# EAGLE design A214B (EAGLE 6.6.0)
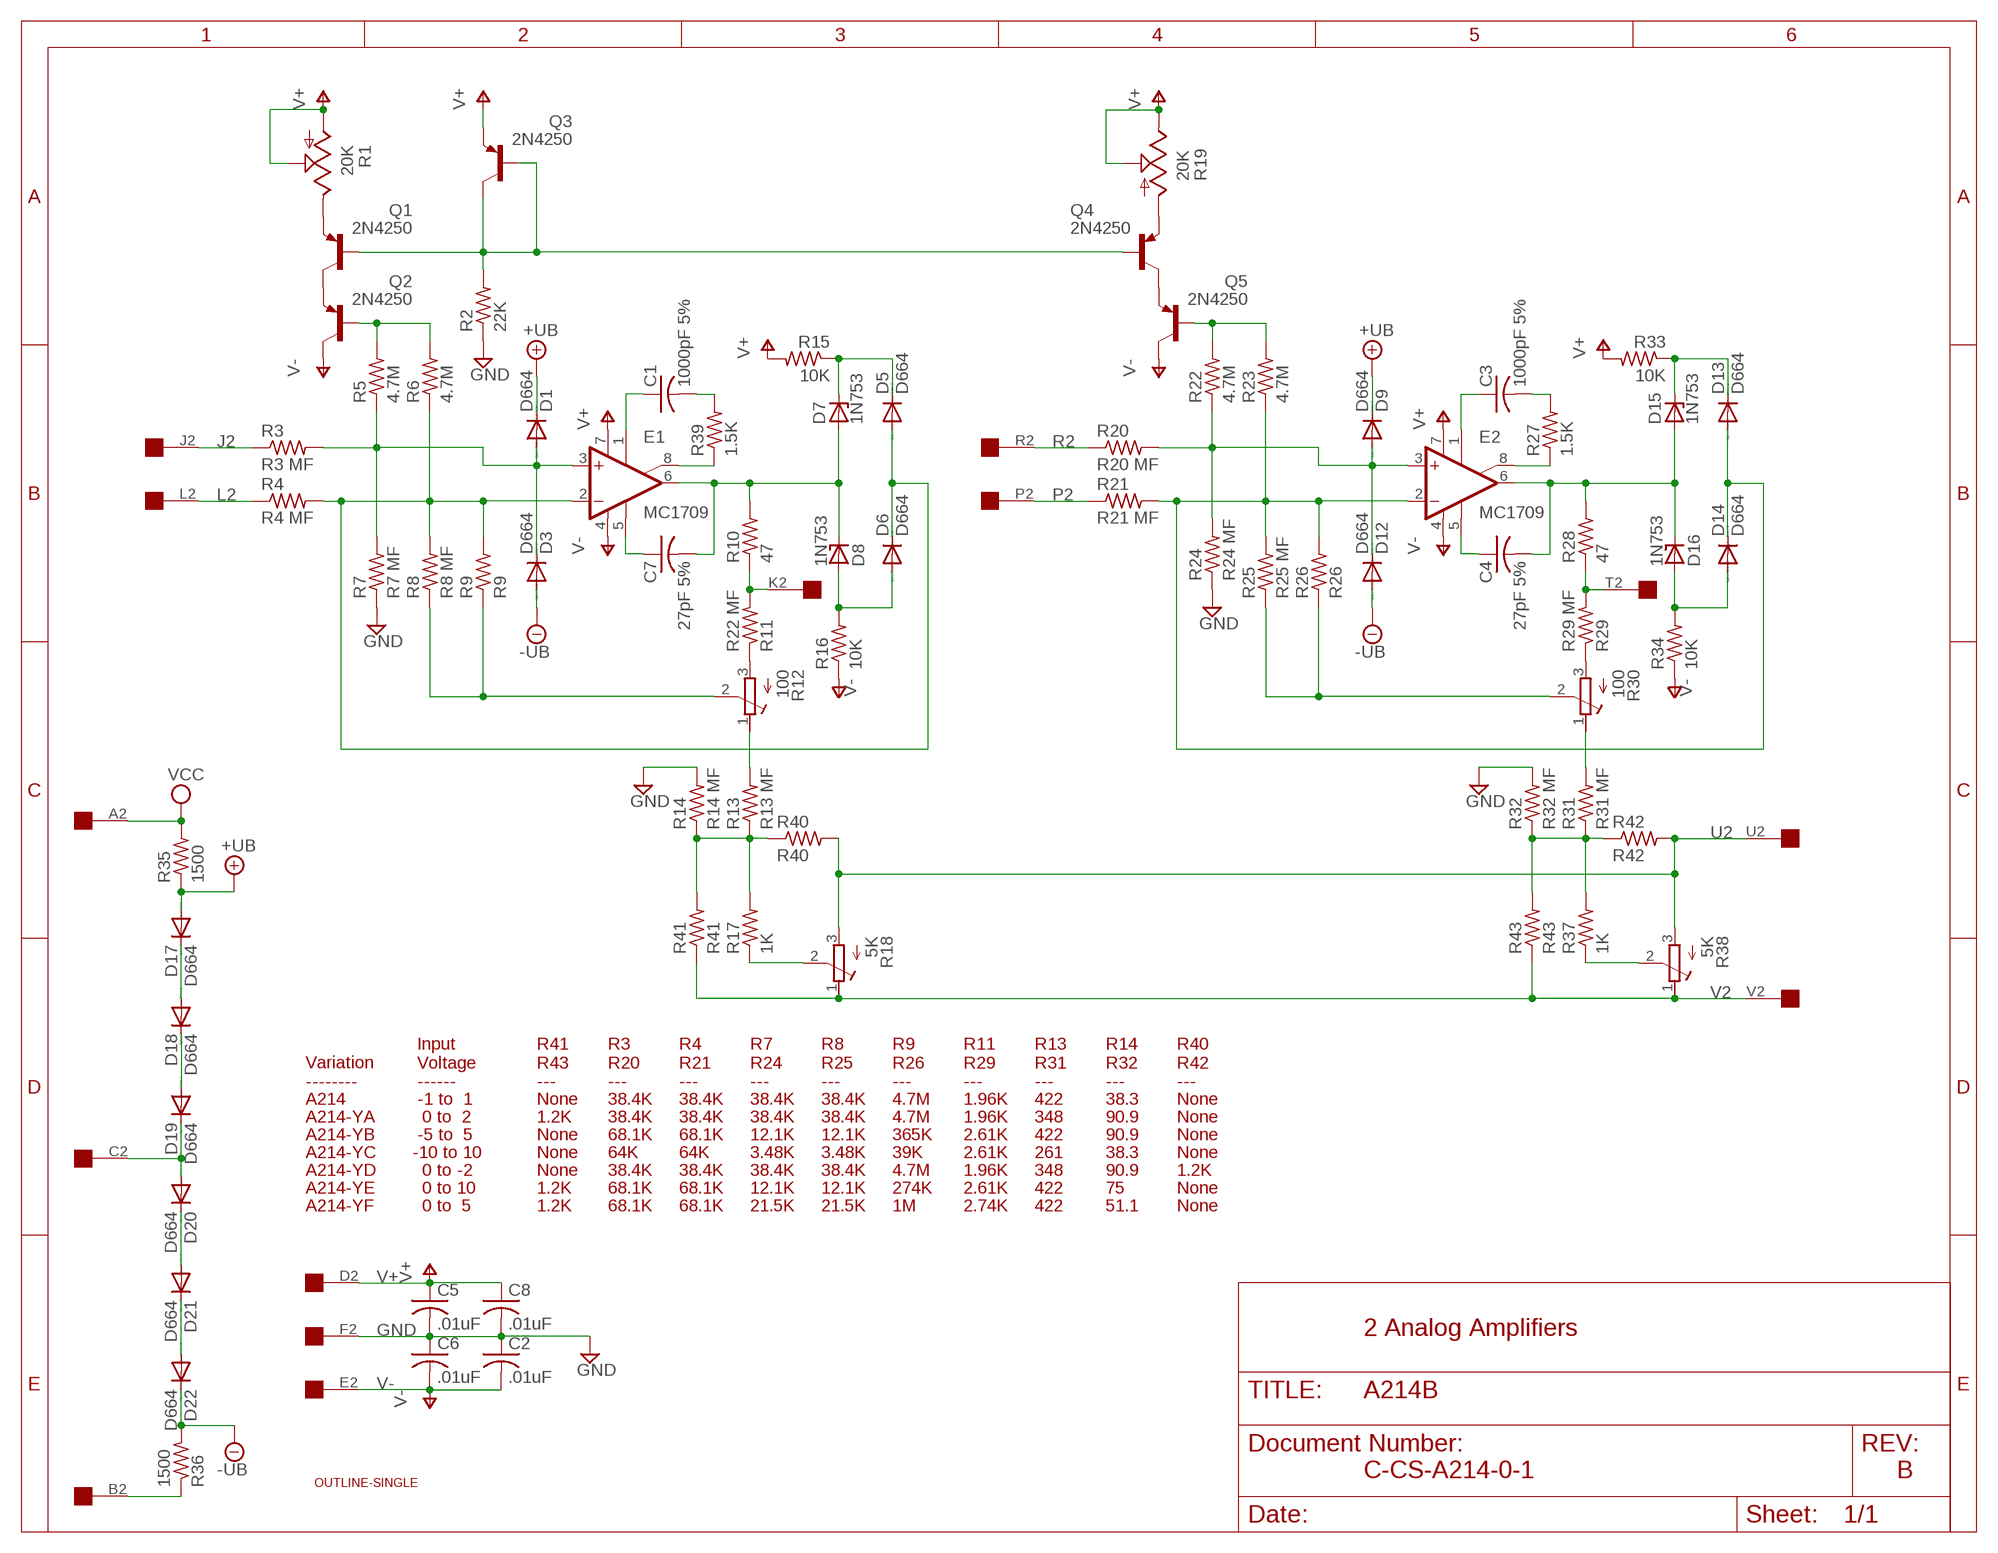
[diagram p0: schematic, sheet 1]

## Parts
C1  1000pF 5%  C-US050-030X075  [C050-030X075]
C2  .01uF  C-US  [C063-025X075]
C3  1000pF 5%  C-US050-030X075  [C050-030X075]
C4  27pF 5%  C-US  [C063-025X075]
C5  .01uF  C-US  [C063-025X075]
C6  .01uF  C-US  [C063-025X075]
C7  27pF 5%  C-US  [C063-025X075]
C8  .01uF  C-US  [C063-025X075]
D1  D664  DIODE-DO35-10  [DO35-10]
D3  D664  DIODE-DO35-10  [DO35-10]
D5  D664  DIODE-DO35-10  [DO35-10]
D6  D664  DIODE-DO35-10  [DO35-10]
D7  1N753  ZENER-DIODEDO41Z10  [DO41Z10]
D8  1N753  ZENER-DIODEDO41Z10  [DO41Z10]
D9  D664  DIODE-DO35-10  [DO35-10]
D12  D664  DIODE-DO35-10  [DO35-10]
D13  D664  DIODE-DO35-10  [DO35-10]
D14  D664  DIODE-DO35-10  [DO35-10]
D15  1N753  ZENER-DIODEDO41Z10  [DO41Z10]
D16  1N753  ZENER-DIODEDO41Z10  [DO41Z10]
D17  D664  DIODE-DO35-10  [DO35-10]
D18  D664  DIODE-DO35-10  [DO35-10]
D19  D664  DIODE-DO35-10  [DO35-10]
D20  D664  DIODE-DO35-10  [DO35-10]
D21  D664  DIODE-DO35-10  [DO35-10]
D22  D664  DIODE-DO35-10  [DO35-10]
E1  MC1709  [H08C]
E2  MC1709  [H08C]
Q1  2N4250  -PNP-TO5  [TO5]
Q2  2N4250  -PNP-TO5  [TO5]
Q3  2N4250  -PNP-TO5  [TO5]
Q4  2N4250  -PNP-TO5  [TO5]
Q5  2N4250  -PNP-TO5  [TO5]
R1  20K  TRIM_US-B25P  [B25P]
R2  22K  R-US_0207/10  [0207/10]
R3  R3 MF  R-US_0207/15  [0207/15]
R4  R4 MF  R-US_0207/15  [0207/15]
R5  4.7M  R-US_0207/10  [0207/10]
R6  4.7M  R-US_0207/10  [0207/10]
R7  R7 MF  R-US_0207/15  [0207/15]
R8  R8 MF  R-US_0207/15  [0207/15]
R9  R9  R-US_0207/10  [0207/10]
R10  47  R-US_0207/10  [0207/10]
R11  R22 MF  R-US_0207/15  [0207/15]
R12  100  275P  [3006Y]
R13  R13 MF  R-US_0207/15  [0207/15]
R14  R14 MF  R-US_0207/15  [0207/15]
R15  10K  R-US_0207/10  [0207/10]
R16  10K  R-US_0207/10  [0207/10]
R17  1K  R-US_0207/10  [0207/10]
R18  5K  275P  [3006Y]
R19  20K  TRIM_US-B25P  [B25P]
R20  R20 MF  R-US_0207/15  [0207/15]
R21  R21 MF  R-US_0207/15  [0207/15]
R22  4.7M  R-US_0207/10  [0207/10]
R23  4.7M  R-US_0207/10  [0207/10]
R24  R24 MF  R-US_0207/15  [0207/15]
R25  R25 MF  R-US_0207/15  [0207/15]
R26  R26  R-US_0207/10  [0207/10]
R27  1.5K  R-US_0207/10  [0207/10]
R28  47  R-US_0207/10  [0207/10]
R29  R29 MF  R-US_0207/15  [0207/15]
R30  100  275P  [3006Y]
R31  R31 MF  R-US_0207/15  [0207/15]
R32  R32 MF  R-US_0207/15  [0207/15]
R33  10K  R-US_0207/10  [0207/10]
R34  10K  R-US_0207/10  [0207/10]
R35  1500  R-US_0207/10  [0207/10]
R36  1500  R-US_0207/10  [0207/10]
R37  1K  R-US_0207/10  [0207/10]
R38  5K  275P  [3006Y]
R39  1.5K  R-US_0207/10  [0207/10]
R40  R40  R-US_0207/10  [0207/10]
R41  R41  R-US_0207/10  [0207/10]
R42  R42  R-US_0207/10  [0207/10]
R43  R43  R-US_0207/10  [0207/10]
U$1  OUTLINE-SINGLE  [SINGLE]
U$2  SINGLE  [EDGE-CON2]

## Nets
+UB: D1.C D9.C D17.A R35.1
-UB: D3.A D12.A D22.C R36.2
B2: R36.1 U$2.B2
GND: C2.1 C5.2 C6.1 C8.2 R2.1 R7.1 R14.2 R24.1 R32.2 U$2.F2
J2: R3.1 U$2.J2
K2: R10.1 R11.2 U$2.K2
L2: R4.1 U$2.L2
N$1: Q1.1(E) R1.E
N$2: Q1.3(C) Q2.1(E)
N$3: Q2.2(B) R5.2 R6.2
N$4: Q1.2(B) Q3.2(B) Q3.3(C) Q4.2(B) R2.2
N$5: D1.A D3.C E1.3(+IN) R3.2 R5.1 R7.2
N$6: D5.A D6.C E1.2(-IN) R4.2 R6.1 R8.2 R9.2
N$7: R8.1 R9.1 R12.2(S)
N$8: C1.1 E1.1(ON1)
N$9: D17.C D18.A
N$10: C1.2 R39.2
N$11: D21.C D22.A
N$12: D20.C D21.A
N$13: D19.C D20.A U$2.C2
N$14: D18.C D19.A
N$15: E1.8(ON2) R39.1
N$16: C7.1 E1.5(OPT)
N$17: C7.2 D7.A D8.C E1.6(OUT) R10.2
N$18: D6.A D8.A R16.2
N$19: D5.C D7.C R15.1
N$20: Q4.1(E) R19.A
N$21: R11.1 R12.3(E)
N$22: R12.1(A) R13.2
N$23: R13.1 R14.1 R17.2 R40.1 R41.2
N$24: R17.1 R18.2(S)
N$25: C3.2 R27.2
N$28: Q4.3(C) Q5.1(E)
N$30: Q5.2(B) R22.2 R23.2
N$31: D9.A D12.C E2.3(+IN) R20.2 R22.1 R24.2
N$32: R25.1 R26.1 R30.2(S)
N$33: C3.1 E2.1(ON1)
N$34: C4.2 D15.A D16.C E2.6(OUT) R28.2
N$35: E2.8(ON2) R27.1
N$36: C4.1 E2.5(OPT)
N$38: D14.A D16.A R34.2
N$39: D13.C D15.C R33.1
N$40: D13.A D14.C E2.2(-IN) R21.2 R23.1 R25.2 R26.2
N$42: R29.1 R30.3(E)
N$43: R30.1(A) R31.2
N$44: R31.1 R32.1 R37.2 R42.1 R43.2
N$45: R37.1 R38.2(S)
P2: R21.1 U$2.P2
R2: R20.1 U$2.R2
T2: R28.1 R29.2 U$2.T2
U2: R18.3(E) R38.3(E) R40.2 R42.2 U$2.U2
V2: R18.1(A) R38.1(A) R41.1 R43.1 U$2.V2
V+: C5.1 C8.1 E1.7(V+) E2.7(V+) Q3.1(E) R1.A R1.S R15.2 R19.E R19.S R33.2 U$2.D2
V-: C2.2 C6.2 E1.4(V-) E2.4(V-) Q2.3(C) Q5.3(C) R16.1 R34.1 U$2.E2
VCC: R35.2 U$2.A2
Unconnected: U$2.A1 U$2.B1 U$2.C1 U$2.D1 U$2.E1 U$2.F1 U$2.H1 U$2.H2 U$2.J1 U$2.K1 U$2.L1 U$2.M1 U$2.M2 U$2.N1 U$2.N2 U$2.P1 U$2.R1 U$2.S1 U$2.S2 U$2.T1 U$2.U1 U$2.V1

## Notes on the sheet
- Variation
  --------
- Input
   Voltage
   ------
- R41
  R43
  ---
- R3
  R20
  ---
- R4
  R21
  ---
- R7
  R24
  ---
- R8
  R25
  ---
- R9
  R26
  ---
- R11
  R29
  ---
- R13
  R31
  ---
- R14
  R32
  ---
- R40
  R42
  ---
- A214 | -1 to  1 | None | 38.4K | 38.4K | 38.4K | 38.4K | 4.7M | 1.96K | 422 | 38.3 | None
- A214-YA | 0 to  2 | 1.2K | 38.4K | 38.4K | 38.4K | 38.4K | 4.7M | 1.96K | 348 | 90.9 | None
- A214-YB | -5 to  5 | None | 68.1K | 68.1K | 12.1K | 12.1K | 365K | 2.61K | 422 | 90.9 | None
- A214-YC | -10 to 10 | None | 64K | 64K | 3.48K | 3.48K | 39K | 2.61K | 261 | 38.3 | None
- A214-YD | 0 to -2 | None | 38.4K | 38.4K | 38.4K | 38.4K | 4.7M | 1.96K | 348 | 90.9 | 1.2K
- A214-YE | 0 to 10 | 1.2K | 68.1K | 68.1K | 12.1K | 12.1K | 274K | 2.61K | 422 | 75 | None
- A214-YF | 0 to  5 | 1.2K | 68.1K | 68.1K | 21.5K | 21.5K | 1M | 2.74K | 422 | 51.1 | None
- 2 Analog Amplifiers
- C-CS-A214-0-1 | B

## Library data of the parts
C1 C3 = rcl:C-US: CAPACITOR, American symbol
C2 C4-C8 = dec-con:C-US: Capacitors with funky DEC lead spacing.
D1 D3 D5 D6 D9 D12-D14 D17-D22 = diode:DIODE-: DIODE
D7 D8 D15 D16 = diode:ZENER-DIODE: Z-Diode
E1 E2 = dec-con:MC1709: OP AMP
Q1-Q5 = transistor:*-PNP-: PNP Transistror
R1 R19 = pot:TRIM_US-: POTENTIOMETER
R2-R11 R13-R17 R20-R29 R31-R37 R39-R43 = rcl:R-US_: RESISTOR, American symbol
R12 R18 R30 R38 = dec-con:275P: Trimpot with 275P (3006Y) footprint.
U$1 = dec-con:OUTLINE-*: Board outlines for DEC boards.
U$2 = dec-con:SINGLE: Single-Height DEC board

## Board
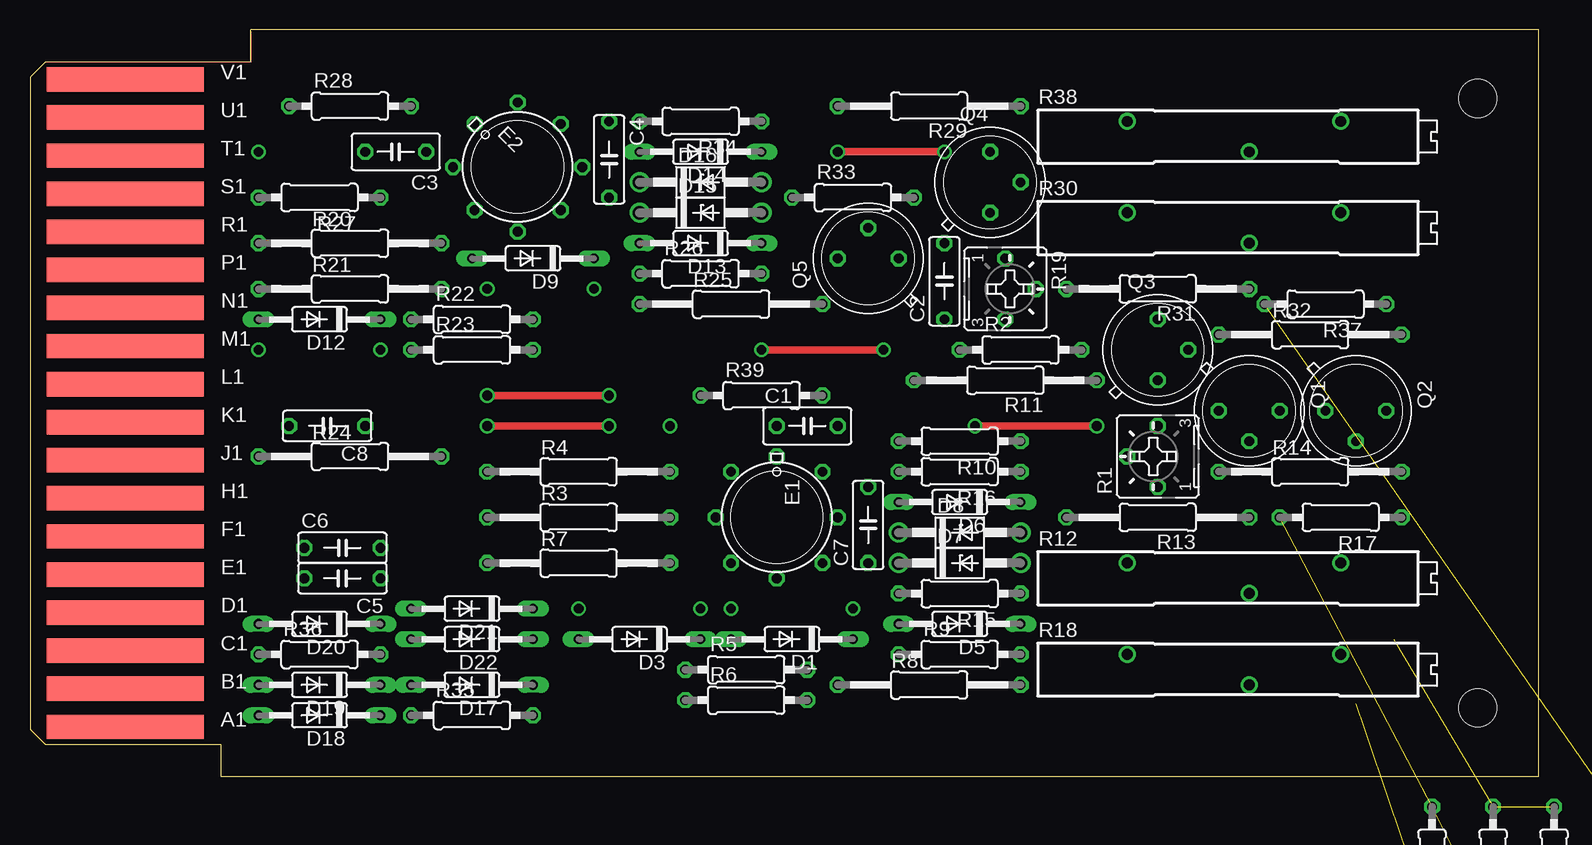
[diagram p1: board, top side]
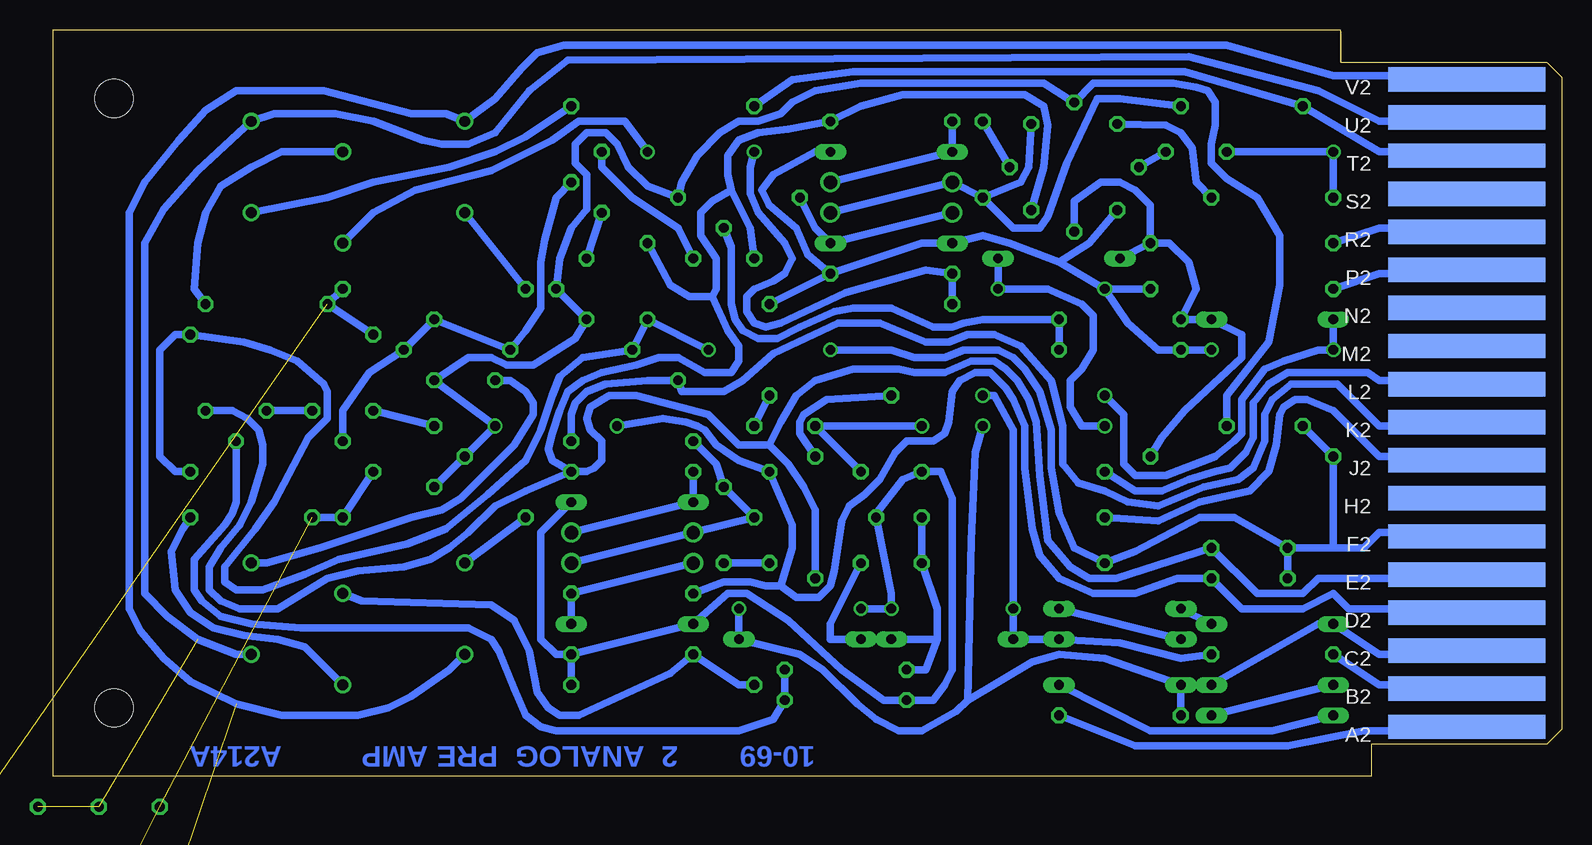
[diagram p2: board, bottom side, seen from below]

Size 125.73 x 62.23 mm. Coordinates in mm from the lower left corner, seen from the top.
Copper layers (1+16): Top 0.035mm / dielectric 1.5mm / Bottom 0.035mm
Design rules "16mils *": minimum track width 16mil, minimum drill 32mil, track to track 13mil, track to pad 10mil, pad to pad 10mil, via to via 10mil, smd to smd 10mil, copper to edge 13mil, drill to drill 10mil, minimum pad ring 10mil, minimum via ring 8mil, stop-mask expansion 0mil, vias tented up to drill 0mil, thermal gap 10mil

### Footprints (pad centres in the part's own frame; a part is rotated, then mirrored left to right if it is on the bottom)
C050-030X075 = drill 0.813 octagon: 1 -2.54,0; 2 2.54,0
C063-025X075 = drill 0.813 octagon: 1 -2.54,0; 2 3.81,0
DO35-10 = drill 0.813 long: A 5.08,0; C -5.08,0
DO41Z10 = drill 1.118: A 5.08,0; C -5.08,0
H08C = drill 0.813 octagon: 1 -3.81,-3.81; 2 0,-5.08; 3 3.81,-3.81; 4 5.08,0; 5 3.81,3.81; 6 0,5.08; 7 -3.81,3.81; 8 -5.08,0
TO5 = drill 0.813 octagon: 1 0,-2.54; 2 2.54,0; 3 0,2.54
B25P = drill 0.813 octagon: A -2.54,0; E 2.54,0; S 0,2.54
0207/10 = drill 0.813 octagon: 1 -5.08,0; 2 5.08,0
0207/15 = drill 0.813 octagon: 1 -7.62,0; 2 7.62,0
3006Y = drill 0.9: 1 -8.89,1.27; 2 1.27,-1.27; 3 8.89,1.27
SINGLE = hole 3.175: 120.65,56.515; 120.65,5.715
EDGE-CON2 = smd 13.106 x 2.032: A1 7.938,4.128; B1 7.938,7.303; C1 7.938,10.477; D1 7.938,13.652; E1 7.938,16.828; F1 7.938,20.003; H1 7.938,23.177; J1 7.938,26.352; K1 7.938,29.527; L1 7.938,32.703; M1 7.938,35.877; N1 7.938,39.053; P1 7.938,42.227; R1 7.938,45.403; S1 7.938,48.578; T1 7.938,51.752; U1 7.938,54.928; V1 7.938,58.102 | smd 13.106 x 2.032 bottom: A2 7.938,4.128; B2 7.938,7.303; C2 7.938,10.477; D2 7.938,13.652; E2 7.938,16.828; F2 7.938,20.003; H2 7.938,23.177; J2 7.938,26.352; K2 7.938,29.527; L2 7.938,32.703; M2 7.938,35.877; N2 7.938,39.053; P2 7.938,42.227; R2 7.938,45.403; S2 7.938,48.578; T2 7.938,51.752; U2 7.938,54.928; V2 7.938,58.102

### Placement (x,y rotation side)
C1  64.77,29.21 0 top
C2  76.2,40.64 90 top
C3  30.48,52.07 180 top
C4  48.26,52.07 270 top
C5  26.67,16.51 180 top
C6  25.4,19.05 0 top
C7  69.85,20.32 90 top
C8  25.4,29.21 180 top
D1  63.5,11.43 180 top
D3  50.8,11.43 180 top
D5  77.47,12.7 180 top
D6  77.47,22.86 180 top
D7  77.47,17.78 0 top
D8  77.47,20.32 0 top
D9  41.91,43.18 180 top
D12  24.13,38.1 180 top
D13  55.88,44.45 180 top
D14  55.88,52.07 180 top
D15  55.88,46.99 0 top
D16  55.88,49.53 0 top
D17  36.83,7.62 180 top
D18  24.13,5.08 180 top
D19  24.13,7.62 180 top
D20  24.13,12.7 180 top
D21  36.83,13.97 180 top
D22  36.83,11.43 180 top
E1  62.23,21.59 270 top
E2  40.64,50.8 315 top
Q1  101.6,30.48 270 top
Q2  110.49,30.48 270 top
Q3  93.98,35.56 0 top
Q4  80.01,49.53 0 top
Q5  69.85,43.18 90 top
R1  93.98,26.67 90 top
R2  82.55,35.56 0 top
R3  45.72,21.59 0 top
R4  45.72,25.4 0 top
R5  59.69,8.89 0 top
R6  59.69,6.35 0 top
R7  45.72,17.78 0 top
R8  74.93,7.62 0 top
R9  77.47,10.16 0 top
R10  77.47,27.94 180 top
R11  81.28,33.02 180 top
R12  100.33,16.51 0 top
R13  93.98,21.59 180 top
R14  106.68,25.4 0 top
R15  77.47,15.24 180 top
R16  77.47,25.4 180 top
R17  109.22,21.59 180 top
R18  100.33,8.89 0 top
R19  81.28,40.64 270 top
R20  26.67,44.45 0 top
R21  26.67,40.64 0 top
R22  36.83,38.1 0 top
R23  36.83,35.56 0 top
R24  26.67,26.67 0 top
R25  58.42,39.37 0 top
R26  55.88,41.91 0 top
R27  24.13,48.26 180 top
R28  26.67,55.88 0 top
R29  74.93,55.88 180 top
R30  100.33,45.72 0 top
R31  93.98,40.64 180 top
R32  106.68,36.83 0 top
R33  68.58,48.26 0 top
R34  55.88,54.61 180 top
R35  36.83,5.08 0 top
R36  24.13,10.16 0 top
R37  107.95,39.37 180 top
R38  100.33,53.34 0 top
R39  60.96,31.75 0 top
R40  121.92,-7.62 90 top
R41  116.84,-7.62 90 top
R42  127,-7.62 90 top
R43  132.08,-7.62 90 top  (outside the outline)
U$1  0,0 0 top
U$2  0,0 0 top

### Tracks (layer width: path | path; a pad name or v marks a point on that pad's centre or on a via)
+UB  (via drill 0.81)
  Top 0.61: v38.1,29.21 v48.26,29.21
  Bottom 0.61: R35.1 D17.A 38.1,9.84 41.91,10.16 44.13,9.53 49.53,6.35 | 49.53,6.35 49.21,19.68 48.9,26.99 v48.26,29.21 | v38.1,29.21 40.01,29.21 40.96,30.8 40.96,33.02 40.01,33.97 39.05,35.56 39.05,38.42 40.01,39.37 42.86,40.64 v46.99,40.64 D9.C | 49.53,6.35 50.48,5.4 53.34,3.81 55.25,3.81 57.15,4.76 58.74,6.03 61.6,8.89 63.5,10.16 D1.C v68.58,13.97
-UB  (via drill 0.81)
  Top 0.61: v38.1,31.75 v48.26,31.75
  Bottom 0.61: R36.2 31.75,9.84 36.83,11.11 D22.C D3.A v45.72,13.97 45.72,28.89 47.31,31.75 v48.26,31.75 | v38.1,31.75 36.51,30.16 36.51,26.04 35.56,25.08 33.02,25.08 28.89,26.67 27.31,27.94 26.67,28.57 26.67,31.43 24.77,33.97 23.18,34.61 20.32,35.56 v19.05,35.56 D12.A
B2
  Bottom 0.61: U$2.B2 8.89,7.62 15.24,7.62 R36.1
GND  (via drill 0.81)
  Top 0.61: v60.96,35.56 v71.12,35.56
  Bottom 0.61: U$2.F2 8.89,20.32 15.24,20.32 16.51,19.05 19.05,19.05 | 19.05,19.05 C6.1 | 19.05,19.05 R24.1 C8.2 | C5.2 C6.1 | C6.1 27.31,21.59 30.16,21.59 35.56,18.73 R7.1 40.64,19.05 41.91,21.91 42.55,25.72 42.55,28.89 43.5,32.07 44.77,33.97 45.72,34.92 46.99,35.56 49.85,35.56 51.44,34.92 53.98,34.92 55.88,35.56 v60.96,35.56 | R14.2 115.57,25.4 116.84,26.67 116.84,35.56 115.57,36.83 R32.2 109.86,36.2 107.63,35.56 105.41,34.61 103.19,32.7 102.87,32.07 102.87,29.84 104.46,28.26 107.32,22.86 108.9,20.64 111.44,17.46 111.44,16.19 110.49,15.56 108.27,15.56 104.78,16.83 101.92,18.1 96.2,19.37 93.03,20.64 89.54,23.5 86.36,26.35 85.09,28.89 84.14,31.75 83.5,33.34 81.6,34.92 R2.1 C2.1 v71.12,35.56
J2
  Bottom 0.61: R3.1 33.66,21.27 30.16,22.86 26.04,23.81 24.45,25.4 23.81,27.62 23.5,30.16 23.18,30.8 22.23,31.43 21.27,31.43 19.05,30.48 15.24,26.67 8.89,26.67 U$2.J2
K2
  Bottom 0.61: U$2.K2 8.89,29.21 15.24,29.21 18.73,32.7 22.54,32.7 24.13,31.43 24.77,30.16 24.77,27.94 25.72,25.72 26.99,24.77 29.85,24.13 33.66,22.54 36.2,22.86 38.1,23.81 40.32,24.45 41.59,26.04 41.59,29.21 42.55,33.02 45.09,35.88 47.31,36.83 49.53,36.83 51.12,36.2 53.02,36.2 56.83,37.78 60.33,37.78 65.72,35.24 68.26,33.02 69.85,32.07 73.34,32.07 R11.2 76.2,33.02 79.69,32.7 81.28,32.07 82.23,31.11 82.55,30.16 R10.1
L2
  Bottom 0.61: U$2.L2 8.89,33.02 15.24,33.02 16.19,33.66 22.86,33.66 24.45,32.7 25.72,31.11 25.72,28.26 26.35,26.99 27.62,25.72 28.89,25.4 31.12,24.77 33.34,23.81 35.56,23.81 R4.1
N$1
  Bottom 0.61: R1.E Q1.1
N$2
  Bottom 0.61: Q1.3 Q2.1
N$3
  Bottom 0.61: R5.2 R6.2 65.72,4.76 68.58,3.81 83.82,3.81 85.09,4.13 86.36,5.08 87.31,7.3 88.58,10.48 89.22,11.43 91.12,12.38 105.09,12.38 109.22,12.7 111.76,13.34 113.35,14.61 113.98,15.56 113.98,18.1 111.44,20.95 110.81,21.91 110.49,22.86 Q2.2
N$4
  Bottom 0.61: Q1.2 101.6,30.48 99.38,33.66 Q3.2 Q3.3 R2.2 86.36,37.15 85.09,39.05 85.09,42.86 84.77,44.77 83.82,48.26 Q4.2
N$5
  Bottom 0.61: E1.3 60.96,12.7 60.96,11.43 D1.A D3.C 52.07,11.43 | R3.2 R7.2 52.07,13.97 52.07,11.43 | R5.1 53.02,8.89 52.07,11.43
N$6  (via drill 0.81)
  Bottom 0.61: v58.42,13.97 v55.88,13.97 55.88,15.24 E1.2 57.15,21.91 54.93,24.77 R4.2 51.75,25.4 50.8,23.18 50.8,8.89 51.44,7.62 52.39,6.35 R6.1 56.52,6.35 60.01,8.89 64.45,13.02 67.95,15.24 69.53,15.24 D5.A R9.2 | R9.2 83.82,10.16 85.09,11.43 85.09,20.32 D6.C | R8.2 R9.2
N$7
  Bottom 0.61: R12.2 100.01,14.61 89.22,14.29 87.31,13.02 86.04,10.48 85.41,6.99 84.46,5.71 83.5,5.08 81.92,5.08 74.3,8.57 R9.1 68.58,7.62 R8.1
N$8  (via drill 0.81)
  Bottom 0.61: E1.1 C1.1 v53.34,29.21
N$9
  Bottom 0.61: D18.A 24.13,3.81 34.29,3.81 D17.C
N$10
  Bottom 0.61: R39.2 C1.2
N$11
  Bottom 0.61: D22.A D21.C
N$12
  Bottom 0.61: D20.C D21.A
N$13
  Bottom 0.61: D19.C 20.32,12.7 D20.A 15.24,10.16 8.89,10.16 U$2.C2
N$14
  Bottom 0.61: D19.A D18.C
N$15
  Bottom 0.61: R39.1 61.28,31.43 63.18,30.16 63.5,29.53 63.5,28.57 E1.8
N$16
  Bottom 0.61: E1.5 C7.1
N$17
  Bottom 0.61: D7.A D8.C E1.6 C7.2 70.49,26.04 R10.2
N$18
  Bottom 0.61: D8.A D6.A R16.2
N$19
  Bottom 0.61: D7.C R15.1 D5.C
N$20
  Bottom 0.61: R19.A Q4.1
N$21
  Bottom 0.61: R11.1 87.63,33.02 86.36,32.07 85.73,31.11 85.73,30.16 87.31,27.62 91.76,23.18 93.35,22.23 95.89,21.59 103.51,19.05 107.95,17.78 R12.3
N$22
  Bottom 0.61: R12.1 R13.2
N$23  (2 unrouted)
  Bottom 0.61: R17.2 R13.1 R14.1
N$24
  Bottom 0.61: R18.2 104.78,10.79 107,11.43 109.86,11.75 112.4,12.38 114.3,13.65 115.57,15.56 115.89,18.73 114.94,20.64 R17.1
N$25  (via drill 0.81)
  Bottom 0.61: C3.2 v19.05,52.07 R27.2
N$28
  Bottom 0.61: Q5.1 73.66,45.72 77.47,48.26 80.01,50.8 Q4.3
N$30
  Bottom 0.61: R23.2 R22.2 48.26,38.1 49.85,37.78 50.8,37.47 52.39,37.47 55.88,39.05 59.06,39.05 60.64,38.73 63.5,37.47 65.41,36.51 66.99,36.51 68.26,37.15 68.9,38.1 69.22,39.37 69.22,44.13 Q5.2
N$31
  Bottom 0.61: R20.2 34.29,47.62 35.56,48.9 36.83,49.53 38.42,49.53 40.64,47.94 E2.3 | R20.2 32.7,44.45 31.12,42.86 30.48,40.64 R22.1 D12.C 26.67,36.83 26.67,34.92 31.43,30.48 33.34,28.26 R24.2 | R20.2 D9.A
N$32  (via drill 0.81)
  Top 0.61: v76.2,52.07 v67.31,52.07
  Bottom 0.61: R30.2 99.06,46.99 95.57,48.9 89.22,50.48 84.14,53.02 81.92,54.61 78.11,54.61 v76.2,52.07 | v67.31,52.07 67.63,50.8 67.63,48.58 66.99,46.99 64.77,44.45 64.14,43.18 64.77,41.91 65.72,41.27 67.31,40.64 67.95,40.01 67.95,38.73 67.31,37.78 66.36,37.47 65.09,37.78 59.69,40.32 53.02,42.23 R26.1 R25.1
N$33
  Bottom 0.61: E2.1 C3.1
N$34
  Bottom 0.61: R28.2 36.83,56.52 38.74,56.52 41.28,51.12 42.86,46.67 43.5,45.72 45.72,45.72 C4.2 | C4.2 45.09,49.53 44.45,50.8 E2.6 | C4.2 D16.C D15.A
N$35
  Bottom 0.61: R27.1 30.48,49.53 30.8,52.39 31.75,53.66 33.02,54.29 E2.8
N$36
  Bottom 0.61: E2.5 C4.1
N$38
  Bottom 0.61: R34.2 D14.A D16.A
N$39
  Bottom 0.61: D15.C D13.C 62.23,45.72 R33.1
N$40  (via drill 0.81)
  Bottom 0.61: 41.91,42.86 39.37,44.45 E2.2 | v38.1,40.64 36.2,37.78 33.66,35.56 R23.1 v29.21,35.56 | 41.91,42.86 46.04,44.45 48.26,45.09 D13.A 53.34,44.45 R26.2 | R21.2 v38.1,40.64 | v38.1,40.64 41.91,42.86 | R25.2 R26.2 | R26.2 62.87,43.5 63.82,45.72 66.04,47.62 66.68,48.9 65.72,50.16 62.23,52.07 D14.C | R26.2 61.09,42.01
N$42
  Bottom 0.61: R29.1 86.36,53.34 88.9,52.07 92.71,50.8 99.06,49.53 102.87,48.26 R30.3
N$43
  Bottom 0.61: R31.2 R30.1
N$44  (2 unrouted)
  Bottom 0.61: R32.1 R37.2 R31.1
N$45
  Bottom 0.61: R38.2 106.68,52.07 109.22,50.8 111.76,49.21 113.03,46.99 113.67,44.45 113.98,40.64 R37.1
P2
  Bottom 0.61: U$2.P2 8.89,41.91 15.24,41.91 R21.1
R2
  Bottom 0.61: U$2.R2 8.89,45.72 15.24,45.72 R20.1
T2
  Bottom 0.61: U$2.T2 8.89,52.07 15.24,52.07 R28.1 31.43,58.74 59.06,58.74 64.14,58.1 R29.2
U2  (2 unrouted)
  Bottom 0.61: U$2.U2 8.89,54.61 15.24,54.61 20.32,57.15 31.12,60.01 82.87,59.7 86.04,57.15 88.9,53.66 91.12,52.7 93.35,52.7 94.93,53.02 99.06,54.61 102.24,55.24 107.32,55.24 R38.3 113.67,50.48 116.52,47.31 118.11,44.45 118.11,15.24 116.21,13.34 113.67,11.43 110.49,10.16 R18.3
V2  (2 unrouted)
  Bottom 0.61: U$2.V2 7.62,58.42 19.05,58.42 27.94,60.96 83.19,60.96 85.41,60.33 86.68,59.05 88.9,56.52 R38.1 93.03,55.24 95.89,55.24 103.19,57.15 110.49,57.15 113.03,55.56 115.25,53.02 118.11,49.53 119.38,46.99 119.38,13.97 118.43,12.06 116.52,9.84 114.3,7.94 110.49,6.03 106.68,5.08 100.33,5.08 97.79,5.71 95.89,6.67 92.71,8.89 R18.1
V+  (via drill 0.81)
  Top 0.61: v88.9,29.21 v78.74,29.21
  Bottom 0.61: U$2.D2 8.89,13.97 17.78,13.97 19.05,15.24 21.59,13.97 26.67,13.97 C5.1 32.07,16.51 35.56,15.24 39.05,15.24 41.91,16.51 43.5,18.41 44.13,20.64 44.77,25.72 44.77,29.21 45.72,31.43 46.36,32.38 47.63,33.66 48.9,33.66 50.17,33.02 50.8,32.07 51.12,29.53 51.44,28.57 52.39,27.94 54.61,27.94 55.56,26.99 56.83,24.77 58.1,23.5 59.37,22.54 60.01,21.27 60.64,17.14 60.96,15.88 61.91,14.92 63.82,14.92 65.09,15.88 | C8.1 27.94,31.75 24.45,36.2 23.5,40.96 23.5,45.09 25.4,48.26 27.94,49.85 29.21,51.12 29.21,52.7 28.89,54.29 28.89,56.2 29.53,57.15 30.48,57.47 32.39,57.78 39.05,57.78 E2.7 43.18,57.78 58.42,57.78 62.23,57.15 64.14,56.2 65.09,55.24 66.99,54.61 68.58,54.61 70.17,53.66 72.07,51.75 73.34,49.53 R33.2 76.2,49.21 77.79,50.8 78.74,52.7 79.69,53.66 81.28,53.66 82.23,52.7 82.23,51.12 81.28,50.16 81.28,47.31 82.55,45.72 83.5,43.18 R19.S R19.E 82.23,36.51 85.73,34.29 87.95,34.29 89.22,34.92 91.12,34.92 Q3.1 v88.9,29.21 R1.S R1.A | v78.74,29.21 74.93,29.84 73.03,29.53 72.07,29.21 71.44,28.89 70.49,27.62 68.58,26.35 E1.7 64.14,20.95 64.14,19.05 65.09,15.88 | 65.09,15.88 66.36,15.88 67.63,16.19 69.85,16.19 R15.2
V-
  Bottom 0.61: U$2.E2 8.89,16.51 20.32,16.51 21.59,15.24 25.4,15.24 C6.2 37.15,16.51 39.37,16.51 40.96,17.46 42.86,19.68 43.5,25.08 43.82,29.53 44.45,31.43 45.4,33.02 46.36,33.97 47.31,34.61 49.21,34.61 51.44,33.66 53.98,33.66 55.25,33.97 59.06,33.97 62.23,33.02 63.82,31.75 65.09,29.53 66.04,27.62 | E2.4 43.18,50.8 42.86,54.29 43.18,55.88 44.77,56.83 54.93,56.83 58.42,55.88 R34.1 64.45,53.98 66.99,53.66 68.58,53.02 69.53,51.75 69.53,50.16 69.22,48.9 | 66.04,27.62 68.58,27.62 71.12,30.16 77.15,31.75 79.38,31.75 80.96,30.8 81.28,29.84 80.96,28.89 80.01,27.94 80.01,26.35 80.65,25.72 81.28,25.4 R16.1 | Q2.3 110.81,30.48 109.54,29.84 108.59,28.89 108.27,27.62 108.27,26.04 109.22,22.86 110.17,20.95 111.76,19.05 112.71,17.46 112.71,15.56 111.76,14.61 110.17,13.97 107,13.97 102.87,16.51 100.33,17.14 96.52,17.46 94.3,18.1 92.71,19.05 91.12,20.32 88.9,22.54 86.36,23.81 R16.1 | R16.1 84.14,26.35 84.46,27.3 84.14,28.57 83.5,30.48 82.87,32.07 81.6,33.02 80.01,33.66 77.15,34.29 75.25,34.92 73.66,34.92 71.44,33.66 69.22,33.66 68.58,34.61 68.58,35.88 69.53,37.15 70.8,40.01 | 70.8,40.01 72.71,40.01 74.3,40.96 C2.2 | 70.8,40.01 70.49,40.64 70.49,43.18 71.76,45.09 71.76,46.99 70.8,47.94 69.22,48.9 | 69.22,48.9 67.63,45.72 Q5.3 | E1.4 62.23,22.23 63.18,24.13 64.45,26.04 66.04,27.62
VCC
  Bottom 0.61: U$2.A2 8.89,4.13 8.89,3.81 16.51,3.81 22.86,2.54 35.56,2.54 R35.2

### Text on the board
Bottom: 10-69 | 2 ANALOG PRE AMP | A214A
Document: Rev. B Schematic, Rev. A Layout | Rev. B Layout not yet available.
200bmp: //wsl$/Debian/home/vrs/Eagle/projects/DEC/Axxx/A214/A214Aback.bmp